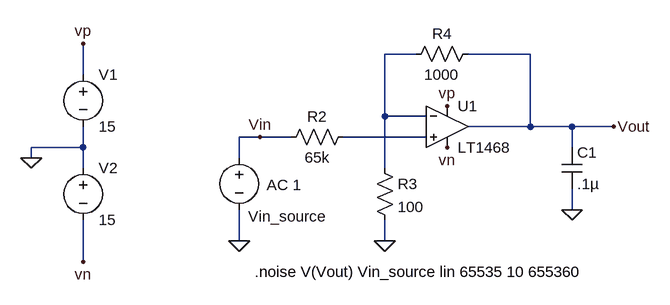
[diagram p0: schematic DC2390_AFE.asc]
DC2390_AFE.asc, the LTspice schematic file:
Version 4
SHEET 1 2236 752
WIRE 160 -272 112 -272
WIRE 336 -272 240 -272
WIRE -352 -240 -352 -288
WIRE 112 -176 112 -272
WIRE 176 -176 112 -176
WIRE 336 -160 336 -272
WIRE 336 -160 240 -160
WIRE 400 -160 336 -160
WIRE 464 -160 400 -160
WIRE -80 -144 -112 -144
WIRE -32 -144 -80 -144
WIRE 176 -144 48 -144
WIRE -352 -128 -352 -160
WIRE -352 -128 -432 -128
WIRE 400 -128 400 -160
WIRE -432 -112 -432 -128
WIRE -112 -112 -112 -144
WIRE -352 -96 -352 -128
WIRE 112 -96 112 -176
WIRE 400 -32 400 -64
WIRE -112 16 -112 -32
WIRE 112 16 112 -16
WIRE -352 48 -352 -16
FLAG -112 16 0
FLAG -80 -144 Vin
FLAG 464 -160 Vout
FLAG 112 16 0
FLAG -432 -112 0
FLAG -352 -288 vp
FLAG 208 -192 vp
FLAG -352 48 vn
FLAG 208 -128 vn
FLAG 400 -32 0
SYMBOL voltage -112 -128 R0
WINDOW 123 42 58 Left 2
WINDOW 39 0 0 Left 2
WINDOW 0 14 106 Left 2
SYMATTR Value2 AC 1
SYMATTR InstName Vin_source
SYMATTR Value ""
SYMBOL res 64 -160 R90
WINDOW 0 0 56 VBottom 2
WINDOW 3 32 56 VTop 2
SYMATTR InstName R2
SYMATTR Value 65k
SYMBOL Opamps\\LT1468 208 -224 R0
SYMATTR InstName U1
SYMBOL res 96 -112 R0
SYMATTR InstName R3
SYMATTR Value 100
SYMBOL res 256 -288 R90
WINDOW 0 0 56 VBottom 2
WINDOW 3 32 56 VTop 2
SYMATTR InstName R4
SYMATTR Value 1000
SYMBOL voltage -352 -256 R0
WINDOW 123 0 0 Left 2
WINDOW 39 0 0 Left 2
SYMATTR InstName V1
SYMATTR Value 15
SYMBOL voltage -352 -112 R0
WINDOW 123 0 0 Left 2
WINDOW 39 0 0 Left 2
SYMATTR InstName V2
SYMATTR Value 15
SYMBOL cap 384 -128 R0
SYMATTR InstName C1
SYMATTR Value .1µ
TEXT -88 64 Left 2 !.noise V(Vout) Vin_source lin 65535 10 655360

The netlist it stands for:
* DC2390_AFE.asc
Vin_source Vin 0 AC 1
R2 N002 Vin 65k
XU1 N002 N001 vp vn Vout LT1468  ; pins In+ In- V+ V- OUT
R3 N001 0 100
R4 Vout N001 1000
V1 vp 0 15
V2 0 vn 15
C1 Vout 0 .1µ
.noise V(Vout) Vin_source lin 65535 10 655360
.backanno
.end